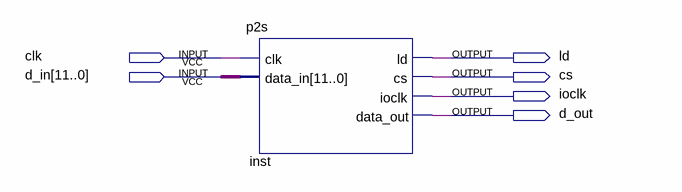
[diagram p0: schematic sheet]
// Quartus schematic p2stest.bdf as structural Verilog: 1 symbols, 6 pins
module p2stest (
  input  clk,
  input  [11:0] d_in,
  output ld,
  output cs,
  output ioclk,
  output d_out
);

  p2s inst (.clk(clk), .data_in(d_in), .ld(ld), .cs(cs), .ioclk(ioclk), .data_out(d_out));
endmodule
